# Altium schematic sheet hv-indicator.SchDoc: hv-indicator
size A4; Date: 05.10.2017; CheckedBy: UNCHECKED; Author: Leon Loeser; Organization: Baltic Racing; Address1: Zur Schwedenschanze 15; Address2: Haus 18; Address3: 18435 Stralsund; Revision: xx.xx; SheetNumber: 9; SheetTotal: 9; Rules: EV5.4.8, EV5.4.9, EV5.4.10; ProjectName: Projekt
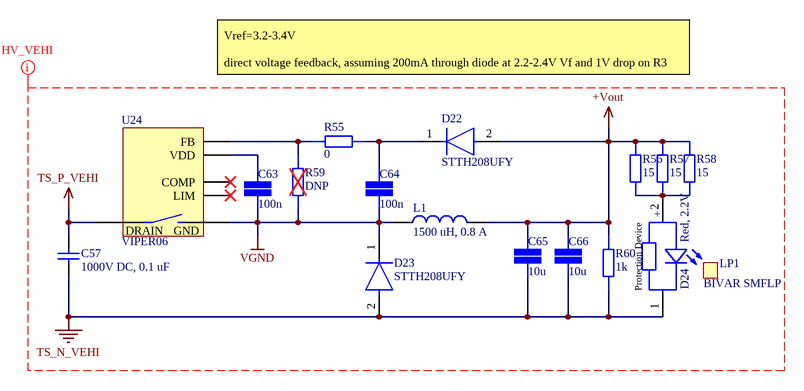
[diagram p0: hv-indicator.SchDoc]

## Parts
C57  1000V DC, 0.1 uF  [WCAP-FTBE_18x8.5x15]
C63  value 100n  [CAP 0603/1608]  (hidden comment: SMD Capacitor)
C64  value 100n  [CAP 0603/1608]  (hidden comment: SMD Capacitor)
C65  value 10u  [CAP 1206/3216]  (hidden comment: SMD Capacitor)
C66  value 10u  [CAP 1206/3216]  (hidden comment: SMD Capacitor)
D22  STTH208UFY  [FP-SMBflat-MFG]
D23  STTH208UFY  [FP-SMBflat-MFG]
D24  Red, 2.2V  [WL-SMDC_3535]
L1  1500 uH, 0.8 A  [WE-PD_1210_Metal base]
LP1  BIVAR SMFLP  [BIVAR_SMFLP]
R55  value 0  [STACKPOLE CSR0603]  (hidden comment: SMD Resistor)
R56  value 15  [STACKPOLE CSR1206]  (hidden comment: SMD Resistor)
R57  value 15  [STACKPOLE CSR1206]  (hidden comment: SMD Resistor)
R58  value 15  [STACKPOLE CSR1206]  (hidden comment: SMD Resistor)
R59  value DNP  [STACKPOLE CSR0603]  (hidden comment: SMD Resistor)
R60  value 1k  [STACKPOLE CSR0603]  (hidden comment: SMD Resistor)
U24  VIPER06  [SSO10_VIPER06]

## Nets
+Vout: C65.2 C66.2 D22.2(A) L1.2 R56.1 R57.1 R58.1 R60.2
TS_N_VEHI: C57.1 C65.1 C66.1 D23.2(A) D24.1(K) R60.1
TS_P_VEHI: C57.2 U24.6(DRAIN)
VGND: C63.1 C64.1 D23.1(K) L1.1 R59.1 U24.1(GND)
NetC63_2: C63.2 U24.2(VDD)
NetC64_2: C64.2 D22.1(K) R55.1
NetD24_2: D24.2(A) R56.2 R57.2 R58.2
NetR55_2: R55.2 R59.2 U24.4(FB)

Not connected (* = marked no-connect by the designer): U24 3(LIM)* 5(COMP)*

## Layout directives
net class HV_VEHI: +Vout, TS_N_VEHI, TS_P_VEHI, VGND

## Notes on the sheet
- Vref=3.2-3.4V
  direct voltage feedback, assuming 200mA through diode at 2.2-2.4V Vf and 1V drop on R3
- Title:
- Projekt:
- Revision:
- Author:
- Rules:
- Checked by:
- Sheet
- of
- Size:
- A4
- Date:
- Time:
- (in symbol 150353RS74500) +; Protection Device

## Library data of the parts
C57 = 890493425009CS: WCAP-FTBE Film Capacitors, 18x8.5x15mm, 1000V DC, 0.1 uF; Value: 0.1 uF; ComponentLink1Description: Manufacturer; ComponentLink1URL: http://www.we-online.de; ComponentLink2Description: Datasheet; ComponentLink2URL: http://katalog.we-online.de/pbs/datasheet/890493425009CS.pdf; Part Number: 890493425009CS; Published Date: Sep. 2017; Publisher: Wurth Elektronik; Rated Voltage: 1000V DC; Size: 18x8.5x15mm; Operating Temperature: -40 °C to +85 °C
C63-C66 = SMD Capacitor: Capacitor with multiple Footprints; Voltage: 6.3V
D22 D23 = CMP-12188-000014-1: DIODE GEN PURP 800V 2A SMBFLAT; Element Configuration: Single; Recovery Time: 53ns; Max Forward Surge Current (Ifsm): 30A; Peak Reverse Current: 5uA; Reverse Recovery Time: 75ns; Forward Voltage: 1.55V; Lead Free: Lead Free; Max Reverse Voltage (DC): 800V; Reverse Voltage (DC): 800V; Min Operating Temperature: -40°C; Max Operating Temperature: 175°C; Package Quantity: 5000; Average Rectified Current: 2A; Max Surge Current: 30A; Packaging: Tape and Reel; Max Repetitive Reverse Voltage (Vrrm): 800V; Mount: Surface Mount; Number of Pins: 2; Forward Current: 2A; REACH SVHC: No SVHC
D24 = 150353RS74500: WL-SMDC SMT Mono-color Ceramic LED Waterclear, size 3535, 2.2V, Red; Manufacturer: Wurth Elektronik; Peak Wavelength: 635nm; Viewing Angle: 125deg; Chip Technology: AlInGaP; ComponentLink1Description: Manufacturer; ComponentLink1URL: http://www.we-online.de; ComponentLink2Description: Datasheet; ComponentLink2URL: https://katalog.we-online.de/led/datasheet/150353RS74500.pdf; Operating Temperature: -40 to +125degC; Emitting Color: Red; Forward Voltage: 2.2V; Manufacturer Part Number: 150353RS74500; Packaging: Tape and Reel; Mounting Technology: SMT; Published Date: October 2019; Size: 3535
L1 = 7447709152: WE-PD SMT Shielded Power Inductor, size 1210, 1500 uH, 0.8 A; Rated Current: 0.8 A; Inductance: 1500 uH; DC Resistance max.: 2.3 Ohm; Self Resonant Frequency: 0.9 MHz; ComponentLink1Description: Manufacturer; ComponentLink1URL: http://www.we-online.de; ComponentLink2Description: Datasheet; ComponentLink2URL: https://katalog.we-online.de/pbs/datasheet/7447709152.pdf; Part Number: 7447709152; Published Date: September 2018; Publisher: Wurth Elektronik; Size: 1210; Operating Temperature: -40 to 125 degC; Mounting Technology: SMT; Packaging: Tape and Reel
LP1 = BIVAR_SMFLP
R55-R60 = SMD Resistor: Resistor with multiple footprints
U24 = VIPER06: Energy saving high voltage converter for direct feedback